# EAGLE design QSPI-Breakout (EAGLE 9.6.2)
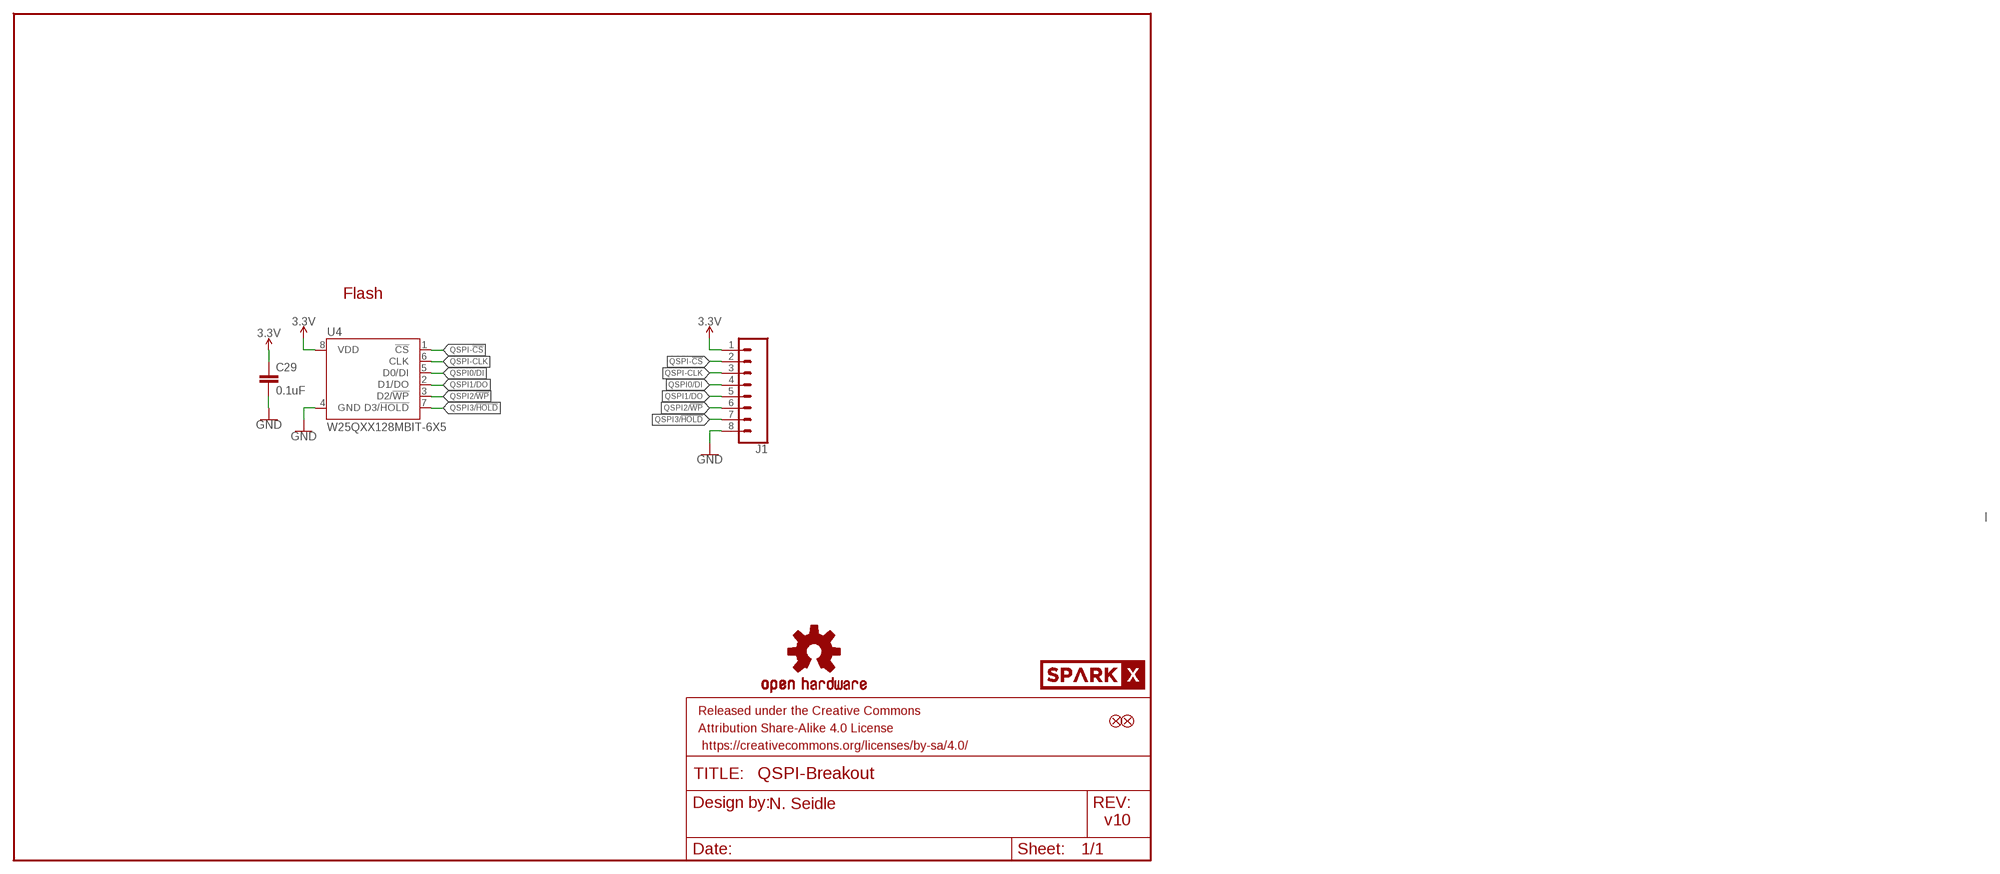
[diagram p0: schematic, sheet 1]

## Parts
C29  0.1uF  0.1UF-0603-25V-(+80/-20%)  [0603]
FD1  FIDUCIALUFIDUCIAL  [FIDUCIAL-MICRO]
FD2  FIDUCIALUFIDUCIAL  [FIDUCIAL-MICRO]
FRAME2  FRAME-LETTER  [CREATIVE_COMMONS]
J1  CONN_08NO_SILK_DNP  [1X08_NO_SILK]
LOGO2  OSHW-LOGONO_SILK  [DUMMY]
U4  W25QXX128MBIT-6X5  W25QXX128MBIT-6X5-SKINNY_CENTER  [WSON-8-6X5-SKINNY_CENTERPAD]
U$3  SPARKX-LOGO4  [SPARKX-MEDIUM]

## Nets
3.3V: C29.1 J1.1 U4.8(VDD)
GND: C29.2 J1.8 U4.4(GND)
QSPI0/DI: J1.4 U4.5(D0/DI)
QSPI1/DO: J1.5 U4.2(D1/DO)
QSPI2/!WP!: J1.6 U4.3(D2/!WP!)
QSPI3/!HOLD!: J1.7 U4.7(D3/!HOLD!)
QSPI-!CS!: J1.2 U4.1(!CS!)
QSPI-CLK [Clock]: J1.3 U4.6(CLK)

## Notes on the sheet
- Flash
- N. Seidle
- v10

## Library data of the parts
C29 = SparkFun-Capacitors:0.1UF: 0.1µF ceramic capacitors A capacitor is a passive two-terminal electrical component used to store electrical energy temporarily in an electric field.; PROD_ID: CAP-00810
FD1 FD2 = SparkFun-Aesthetics:FIDUCIAL: Fiducial Alignment Points Point-of-reference for pick-and-place machines and other optical instruments.
FRAME2 = SparkFun-Aesthetics:FRAME-LETTER: Schematic Frame - Letter Standard 8.5x11 US Letter frame
J1 = SparkFun-Connectors:CONN_08: Multi connection point. Often used as Generic Header-pin footprint for 0.1 inch spaced/style header connections On any of the 0.1 inch spaced packages, you can populate with these: Break Away Headers - Straight <https://www.sparkfun.com/products/116> (PRT-00116) Break Away Male Headers - Right Angle <https://www.sparkfun.com/products/553> (PRT-00553) Female Headers <https://www.sparkfun.com/products/115> (PRT-00115) Break Away Headers - Machine Pin <https://www.sparkfun.com/products/117> (PRT-00117) Break Away Female Headers - Swiss Machine Pin <https://www.sparkfun.com/products/743> (PRT-00743) Arduino Stackable Header - 8 Pin <https://www.sparkfun.com/products/9279> (PRT-09279) For SCREWTERMINALS and SPRING TERMINALS visit here: Screw Terimnals on SparkFun.com <https://www.sparkfun.com/search/results?term=Screw+Terminals> (5mm/3.5mm/2.54mm spacing) This device is also useful as a general connection point to wire up your design to another part of your project. Our various solder wires solder well into these plated through hole pads. Hook-Up Wire - Assortment (Stranded, 22 AWG) <https://www.sparkfun.com/products/11375> (PRT-11375) Hook-Up Wire - Assortment (Solid Core, 22 AWG) <https://www.sparkfun.com/products/11367> (PRT-11367) View the entire wire category on our website here <https://www.sparkfun.com/categories/141> Special notes: Molex polarized connector foot print use with SKU : PRT-08231 with associated crimp pins and housings. 1MM SMD Version SKU: PRT-10208 NOTES ON THE VARIANTS LOCK and LOCK_LONGPADS... This footprint was designed to help hold the alignment of a through-hole component (i.e. 6-pin header) while soldering it into place. You may notice that each hole has been shifted either up or down by 0.005 of an inch from it's more standard position (which is a perfectly straight line). This slight alteration caused the pins (the squares in the middle) to touch the edges of the holes. Because they are alternating, it causes a "brace" to hold the component in place. 0.005 has proven to be the perfect amount of "off-center" position when using our standard breakaway headers. Although looks a little odd when you look at the bare footprint, once you have a header in there, the alteration is very hard to notice. Also,if you push a header all the way into place, it is covered up entirely on the bottom side.
LOGO2 = SparkFun-Aesthetics:OSHW-LOGO: Open-Source Hardware (OSHW) Logo This logo indicates the piece of hardware it is found on incorporates a OSHW license and/or adheres to the definition of open source hardware found here: http://freedomdefined.org/OSHW
U4 = SparkFun-MicroMod:W25QXX; PROD_ID: IC-15107
U$3 = SparkX:SPARKX-LOGO

## Net classes
1 90Ohm: width 0.114 mm, clearance 0.127 mm
2 Clock: width 0.089 mm, clearance 0.178 mm
3 DCBoost: width 0.381 mm

## Board
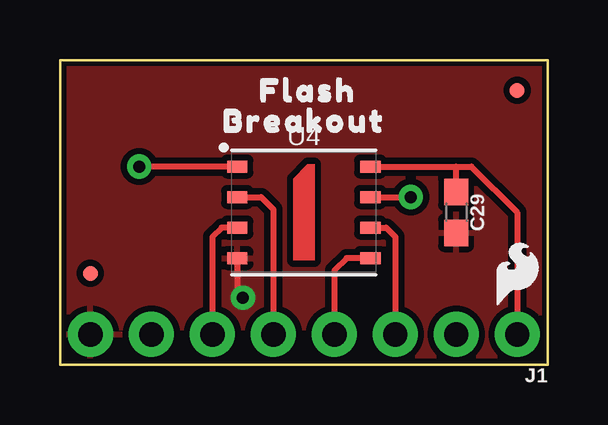
[diagram p1: board, top side]
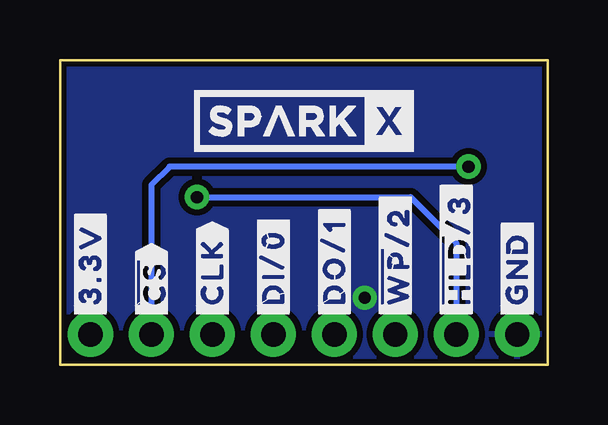
[diagram p2: board, bottom side, seen from below]

Size 20.32 x 12.7 mm. Coordinates in mm from the lower left corner, seen from the top.
Outline: 20.32,0 0,0 0,12.7 20.32,12.7 20.32,0
Copper layers (1*16): Top 0.035mm / dielectric 1.5mm / Bottom 0.035mm
Design rules "SparkFun-2-layer-STANDARD": minimum track width 10mil, minimum drill 20mil, track to track 10mil, track to pad 8mil, pad to pad 8mil, via to via 10mil, smd to smd 8mil, copper to edge 8mil, drill to drill 8mil, minimum pad ring 10mil, minimum via ring 10mil, stop-mask expansion 4mil, vias tented up to drill 25mil, thermal gap 10mil

### Footprints (pad centres in the part's own frame; a part is rotated, then mirrored left to right if it is on the bottom)
0603 = smd 1.1 x 1: 1 -0.85,0; 2 0.85,0
FIDUCIAL-MICRO = smd 0.635 x 0.635: 1 0,0
1X08_NO_SILK = drill 1.016 pad 1.88: 1 0,0; 2 2.54,0; 3 5.08,0; 4 7.62,0; 5 10.16,0; 6 12.7,0; 7 15.24,0; 8 17.78,0
WSON-8-6X5-SKINNY_CENTERPAD = smd 0.85 x 0.5: 1 -2.775,1.905; 2 -2.775,0.635; 3 -2.775,-0.635; 4 -2.775,-1.905; 5 2.775,-1.905; 6 2.775,-0.635; 7 2.775,0.635; 8 2.775,1.905

### Placement (x,y rotation side)
C29  16.51,6.35 270 top
FD1  19.05,11.43 0 top
FD2  1.27,3.81 0 top
FRAME2  -15.24,-11.43 0 top  (outside the outline)
J1  19.05,1.27 180 top
LOGO2  -11.43,-11.43 0 top  (outside the outline)
U4  10.16,6.35 0 top
U$1  [BREAKOUT1]  6.1,10.16 0 top
U$2  [FLASH0]  7.62,11.43 0 top
U$3  10.16,10.16 0 bottom
U$4  [##HLD##3#2]  3.81,1.78 90 bottom
U$5  [##WP##2#3]  6.35,1.78 90 bottom
U$6  [SFE_LOGO_FLAME_.1]  19.05,3.81 0 top
U$7  [#3#3V#1]  19.05,1.78 90 bottom
U$8  [#CLK#6]  13.97,1.78 90 bottom
U$9  [#DI#0#5]  11.43,1.78 90 bottom
U$10  [#DO#1#4]  8.89,1.78 90 bottom
U$11  [#GND#0]  1.27,1.78 90 bottom
U$12  [##CS##7]  16.51,1.78 90 bottom

### Tracks (layer width: path | path; a pad name or v marks a point on that pad's centre or on a via)
3.3V
  Top 0.254: U4.8 16.51,8.26 | 16.51,8.26 17.14,8.26 19.05,6.35 J1.1 | C29.1 16.51,8.26
GND  (via drill 0.51)
  Top 0.254: U4.4 7.38,3.03 v7.62,2.79
  pour Bottom (isolate 0.203): 0,0 0,12.7 20.32,12.7 20.32,0
  pour Top (isolate 0.203): 0,0 0,12.7 20.32,12.7 20.32,0
QSPI0/DI
  Top 0.254: U4.5 11.94,4.45 11.43,3.94 J1.4
QSPI1/DO
  Top 0.254: U4.2 8.38,6.99 8.89,6.48 J1.5
QSPI2/!WP!
  Top 0.254: U4.3 6.73,5.71 6.35,5.33 J1.6
QSPI3/!HOLD!  (via drill 0.51)
  Top 0.254: U4.7 v14.61,6.99
  Bottom 0.254: v14.61,6.99 5.71,6.99 3.81,5.08 J1.7
QSPI-!CS!  (via drill 0.51)
  Top 0.254: U4.1 v3.3,8.26
  Bottom 0.254: v3.3,8.26 15.75,8.26 16.51,7.49 J1.2
QSPI-CLK
  Top 0.254: U4.6 13.59,5.71 13.97,5.33 J1.3